# Altium schematic sheet SD-Socket.SchDoc
size B; SheetNumber: 9; SheetTotal: 17
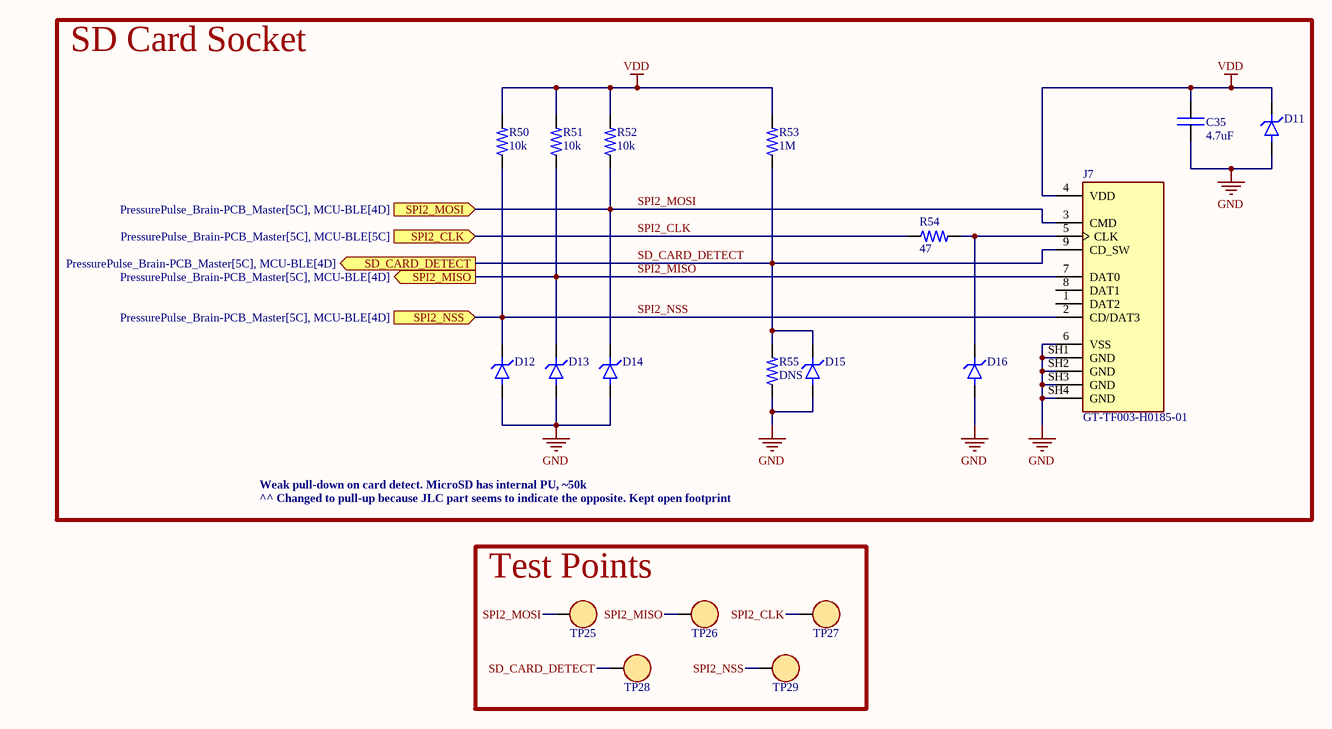
[diagram p0: SD-Socket.SchDoc]

## Parts
C35  value 4.7uF  [0402C]  (hidden comment: CAP)
D11  RCLAMP0521P.TCT  [BDFN2C051V40]  (value not drawn)
D12  RCLAMP0521P.TCT  [BDFN2C051V40]  (value not drawn)
D13  RCLAMP0521P.TCT  [BDFN2C051V40]  (value not drawn)
D14  RCLAMP0521P.TCT  [BDFN2C051V40]  (value not drawn)
D15  RCLAMP0521P.TCT  [BDFN2C051V40]  (value not drawn)
D16  RCLAMP0521P.TCT  [BDFN2C051V40]  (value not drawn)
J7  GT-TF003-H0185-01  [GTTF003H018501]
R50  value 10k  [0402R]  (hidden comment: RES)
R51  value 10k  [0402R]  (hidden comment: RES)
R52  value 10k  [0402R]  (hidden comment: RES)
R53  value 1M  [0402R]  (hidden comment: RES)
R54  value 47  [0402R]  (hidden comment: RES)
R55  value DNS  [0402R]  (hidden comment: RES)
TP25  RH-5019  [TP - RH-5019]  (value not drawn)
TP26  RH-5019  [TP - RH-5019]  (value not drawn)
TP27  RH-5019  [TP - RH-5019]  (value not drawn)
TP28  RH-5019  [TP - RH-5019]  (value not drawn)
TP29  RH-5019  [TP - RH-5019]  (value not drawn)

## Blocks framed on the sheet
SD Card Socket: C35 D11-D16 J7 R50-R55
Test Points: TP25-TP29

## Ports
SD_CARD_DETECT (out, see PressurePulse_Brain-PCB_Master[5C], MCU-BLE[4D]), SPI2_CLK (in, see PressurePulse_Brain-PCB_Master[5C], MCU-BLE[5C]), SPI2_MISO (out, see PressurePulse_Brain-PCB_Master[5C], MCU-BLE[4D]), SPI2_MOSI (in, see PressurePulse_Brain-PCB_Master[5C], MCU-BLE[4D]), SPI2_NSS (in, see PressurePulse_Brain-PCB_Master[5C], MCU-BLE[4D])

## Nets
GND: C35.1 D11.A D12.A D13.A D14.A D15.A D16.A J7.6(VSS) J7.SH1(GND) J7.SH2(GND) J7.SH3(GND) J7.SH4(GND) R55.1
VDD: C35.2 D11.K J7.4(VDD) R50.2 R51.2 R52.2 R53.2
SD_CARD_DETECT: D15.K J7.9(CD_SW) R53.1 R55.2 TP28.1 ; port SD_CARD_DETECT
SPI2_CLK: R54.1 TP27.1 ; port SPI2_CLK
SPI2_MISO: D13.K J7.7(DAT0) R51.1 TP26.1 ; port SPI2_MISO
SPI2_MOSI: D14.K J7.3(CMD) R52.1 TP25.1 ; port SPI2_MOSI
SPI2_NSS: D12.K J7.2(CD/DAT3) R50.1 TP29.1 ; port SPI2_NSS
NetD16_K: D16.K J7.5(CLK) R54.2

Not connected (* = marked no-connect by the designer): J7 1(DAT2) 8(DAT1)

## Notes on the sheet
- Weak pull-down on card detect. MicroSD has internal PU, ~50k
- ^^ Changed to pull-up because JLC part seems to indicate the opposite. Kept open footprint

## Library data of the parts
C35 = CAP: Capacitor; MFR: *; MFR PN: *; JLCPCB PN: *; Footprint: *
D11-D16 = TVS DIODE: 25V Clamp 4A (8/20µs) Ipp Tvs Diode Surface Mount SLP1006P2; MFR: BORN; Type: SMD; Value: BDFN2C051V40; MFR PN: BDFN2C051V40; JLCPCB PN: C152023
J7 = SD-CONN-SMD_JLC: MFR: G-Switch; MFR PN: GT-TF003-H0185-01; Type: SMD; Value: GT-TF003-H0185-01
R50-R55 = RES: Resistor; MFR PN: *; MFR: *
  R50-R52: JLCPCB PN: C843837
  R53: JLCPCB PN: C2991630
  R54 R55: JLCPCB PN: *
TP25-TP29 = TEST POINT: MFR: ronghe; MFR PN: RH-5019; Value: RH-5019; JLCPCB PN: C5199800